# Altium schematic sheet Motherboard PCB.SchDoc
size B; SheetNumber: 1; SheetTotal: 1
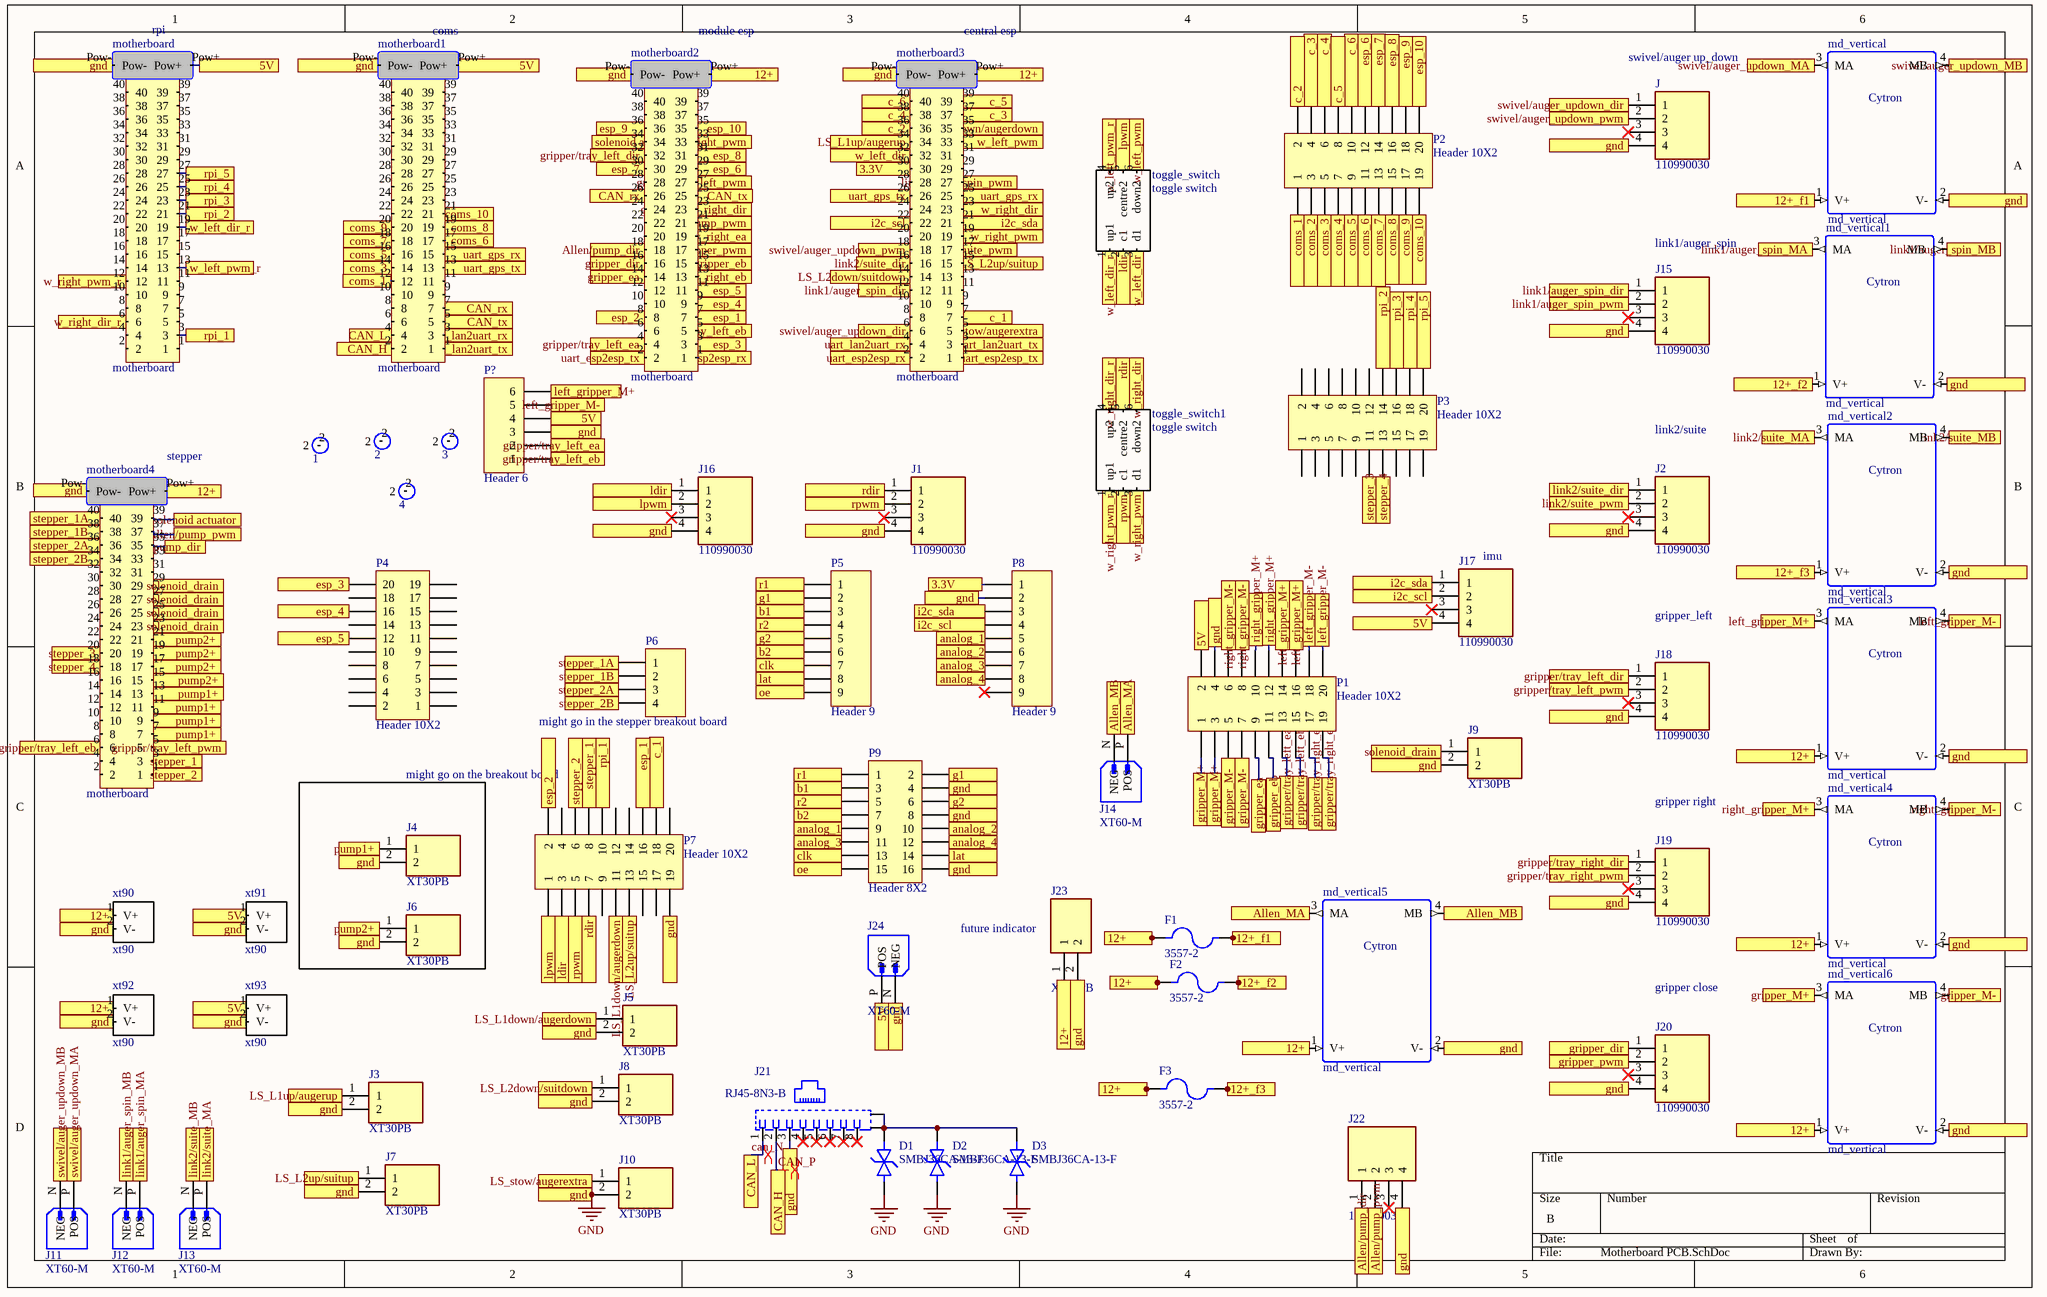
[diagram p0: Motherboard PCB.SchDoc]

## Parts
1  mountinghole_np  [np_mountinghole]  (value not drawn)
2  mountinghole_np  [np_mountinghole]  (value not drawn)
3  mountinghole_np  [np_mountinghole]  (value not drawn)
4  mountinghole_np  [np_mountinghole]  (value not drawn)
D1  SMBJ36CA-13-F  [DIONM4336X250N]
D2  SMBJ36CA-13-F  [DIONM4336X250N]
D3  SMBJ36CA-13-F  [DIONM4336X250N]
F1  3557-2  [FUSE_3557-2]
F2  3557-2  [FUSE_3557-2]
F3  3557-2  [FUSE_3557-2]
J  110990030  [SEEED_110990030]
J1  110990030  [SEEED_110990030]
J2  110990030  [SEEED_110990030]
J3  XT30PB  [XT30PB]
J4  XT30PB  [XT30PB]
J5  XT30PB  [XT30PB]
J6  XT30PB  [XT30PB]
J7  XT30PB  [XT30PB]
J8  XT30PB  [XT30PB]
J9  XT30PB  [XT30PB]
J10  XT30PB  [XT30PB]
J11  XT60-M  [AMASS_XT60-M]
J12  XT60-M  [AMASS_XT60-M]
J13  XT60-M  [AMASS_XT60-M]
J14  XT60-M  [AMASS_XT60-M]
J15  110990030  [SEEED_110990030]
J16  110990030  [SEEED_110990030]
J17  110990030  [SEEED_110990030]
J18  110990030  [SEEED_110990030]
J19  110990030  [SEEED_110990030]
J20  110990030  [SEEED_110990030]
J21  RJ45-8N3-B  [TE_RJ45-8N3-B]
J22  110990030  [SEEED_110990030]
J23  XT30PB  [XT30PB]
J24  XT60-M  [AMASS_XT60-M]
md_vertical  md_vertical  [md_vertical]
md_vertical1  md_vertical  [md_vertical]
md_vertical2  md_vertical  [md_vertical]
md_vertical3  md_vertical  [md_vertical]
md_vertical4  md_vertical  [md_vertical]
md_vertical5  md_vertical  [md_vertical]
md_vertical6  md_vertical  [md_vertical]
motherboard  motherboard  [motherboard 10x2]
motherboard1  motherboard  [motherboard 10x2]
motherboard2  motherboard  [motherboard 10x2]
motherboard3  motherboard  [motherboard 10x2]
motherboard4  motherboard  [motherboard 10x2]
P1  Header 10X2  [HDR2X10]
P2  Header 10X2  [HDR2X10]
P3  Header 10X2  [HDR2X10]
P4  Header 10X2  [HDR2X10]
P5  Header 9  [HDR1X9]
P6  might go in the stepper breakout board  [HDR1X4]
P7  Header 10X2  [HDR2X10]
P8  Header 9  [HDR1X9]
P9  Header 8X2  [HDR2X8]
P?  Header 6  [HDR1X6]
toggle_switch  toggle switch  [toggle switch]
toggle_switch1  toggle switch  [toggle switch]
xt90  xt90  [xt90]
xt91  xt90  [xt90]
xt92  xt90  [xt90]
xt93  xt90  [xt90]

## Blocks framed on the sheet
might go on the breakout board: J4 J6

## Ports
3.3V, 5V, 12+, 12+_f1, 12+_f2, 12+_f3, Allen/pump_dir, Allen/pump_pwm, Allen_MA, Allen_MB, analog_1, analog_2, analog_3, analog_4, b1, b2, c_1, c_2, c_3, c_4, c_5, c_6, CAN_H, CAN_L, CAN_rx, CAN_tx, clk, coms_1, coms_2, coms_3, coms_4, coms_5, coms_6, coms_7, coms_8, coms_9, coms_10, esp_1, esp_2, esp_3, esp_4, esp_5, esp_6, esp_7, esp_8, esp_9, esp_10, g1, g2, gnd, gripper/tray_left_dir, gripper/tray_left_ea, gripper/tray_left_eb, gripper/tray_left_pwm, gripper/tray_right_dir, gripper/tray_right_ea, gripper/tray_right_eb, gripper/tray_right_pwm, gripper_dir, gripper_ea, gripper_eb, gripper_M+, gripper_M-, gripper_pwm, i2c_scl, i2c_sda, lat, ldir, left_gripper_M+, left_gripper_M-, link1/auger_spin_dir, link1/auger_spin_MA, link1/auger_spin_MB, link1/auger_spin_pwm, link2/suite_dir, link2/suite_MA, link2/suite_MB, link2/suite_pwm, lpwm, LS_L1down/augerdown, LS_L1up/augerup, LS_L2down/suitdown, LS_L2up/suitup, LS_stow/augerextra, oe, pump1+, pump2+, r1, r2, rdir, right_gripper_M+, right_gripper_M-, rpi_1, rpi_2, rpi_3, rpi_4, rpi_5, rpwm, solenoid actuator, solenoid_drain, stepper_1, stepper_1A, stepper_1B, stepper_2, stepper_2A, stepper_2B, stepper_3, stepper_4, swivel/auger_updown_dir, swivel/auger_updown_MA, swivel/auger_updown_MB, swivel/auger_updown_pwm, uart_esp2esp_rx, uart_esp2esp_tx, uart_gps_rx, uart_gps_tx, uart_lan2uart_rx, uart_lan2uart_tx, w_left_dir, w_left_dir_r, w_left_pwm, w_left_pwm_r, w_right_dir, w_right_dir_r, w_right_pwm, w_right_pwm_r

## Nets
GND: D1.1 D2.1 D3.1 J.4 J1.4 J2.4 J3.2 J4.2 J5.2 J6.2 J7.2 J8.2 J9.2 J10.2 J15.4 J16.4 J18.4 J19.4 J20.4 J21.3 J22.4 J23.2 J24.N(NEG) md_vertical.2(V-) md_vertical1.2(V-) md_vertical2.2(V-) md_vertical3.2(V-) md_vertical4.2(V-) md_vertical5.2(V-) md_vertical6.2(V-) motherboard.Pow- motherboard1.Pow- motherboard2.Pow- motherboard3.Pow- motherboard4.Pow- P1.4 P7.19 P8.2 P9.4 P9.8 P9.16 P?.3 xt90.2(V-) xt91.2(V-) xt92.2(V-) xt93.2(V-) ; port gnd
3.3V: motherboard3.30 P8.1 ; port 3.3V
5V: J17.4 J24.P(POS) motherboard.Pow+ motherboard1.Pow+ P1.2 P?.4 xt91.1(V+) xt93.1(V+) ; port 5V
12+: F1.1_1 F1.1_2 F2.1_1 F2.1_2 F3.1_1 F3.1_2 J23.1 md_vertical3.1(V+) md_vertical4.1(V+) md_vertical5.1(V+) md_vertical6.1(V+) motherboard2.Pow+ motherboard3.Pow+ motherboard4.Pow+ xt90.1(V+) xt92.1(V+) ; port 12+
12+_f1: F1.2_1 F1.2_2 md_vertical.1(V+) ; port 12+_f1
12+_f2: F2.2_1 F2.2_2 md_vertical1.1(V+) ; port 12+_f2
12+_f3: F3.2_1 F3.2_2 md_vertical2.1(V+) ; port 12+_f3
Allen/pump_dir: J22.1 motherboard2.18 motherboard4.35 ; port Allen/pump_dir
Allen/pump_pwm: J22.2 motherboard2.21 motherboard4.37 ; port Allen/pump_pwm
Allen_MA: J14.P(POS) md_vertical5.3(MA) ; port Allen_MA
Allen_MB: J14.N(NEG) md_vertical5.4(MB) ; port Allen_MB
analog_1: P8.5 P9.9 ; port analog_1
analog_2: P8.6 P9.10 ; port analog_2
analog_3: P8.7 P9.11 ; port analog_3
analog_4: P8.8 P9.12 ; port analog_4
b1: P5.3 P9.3 ; port b1
b2: P5.6 P9.7 ; port b2
c_1: motherboard3.7 P7.18 ; port c_1
c_2: motherboard3.36 P2.2 ; port c_2
c_3: motherboard3.37 P2.4 ; port c_3
c_4: motherboard3.38 P2.6 ; port c_4
c_5: motherboard3.39 P2.8 ; port c_5
c_6: motherboard3.40 P2.10 ; port c_6
can_N: J21.1 motherboard1.4 ; port CAN_L
CAN_P: J21.2 motherboard1.2 ; port CAN_H
CAN_rx: motherboard1.7 motherboard2.26 ; port CAN_rx
CAN_tx: motherboard1.5 motherboard2.25 ; port CAN_tx
clk: P5.7 P9.13 ; port clk
coms_1: motherboard1.12 P2.1 ; port coms_1
coms_2: P2.3 ; port coms_2
coms_3: motherboard1.14 P2.5 ; port coms_3
coms_4: P2.7 ; port coms_4
coms_5: motherboard1.16 P2.9 ; port coms_5
coms_6: motherboard1.17 P2.11 ; port coms_6
coms_7: motherboard1.18 P2.13 ; port coms_7
coms_8: motherboard1.19 P2.15 ; port coms_8
coms_9: motherboard1.20 P2.17 ; port coms_9
coms_10: motherboard1.21 P2.19 ; port coms_10
esp_1: motherboard2.7 P7.16 ; port esp_1
esp_2: motherboard2.8 P7.2 ; port esp_2
esp_3: motherboard2.3 P4.20 ; port esp_3
esp_4: motherboard2.9 P4.16 ; port esp_4
esp_5: motherboard2.11 P4.12 ; port esp_5
esp_6: motherboard2.29 P2.12 ; port esp_6
esp_7: motherboard2.30 P2.14 ; port esp_7
esp_8: motherboard2.31 P2.16 ; port esp_8
esp_9: motherboard2.36 P2.18 ; port esp_9
esp_10: motherboard2.35 P2.20 ; port esp_10
g1: P5.2 P9.2 ; port g1
g2: P5.5 P9.6 ; port g2
gripper/tray_left_dir: J18.1 motherboard2.32 ; port gripper/tray_left_dir
gripper/tray_left_ea: motherboard2.4 P1.13 P?.2 ; port gripper/tray_left_ea
gripper/tray_left_eb: motherboard2.5 motherboard4.6 P1.15 P?.1 ; port gripper/tray_left_eb
gripper/tray_left_pwm: J18.2 motherboard2.27 motherboard4.5 ; port gripper/tray_left_pwm
gripper/tray_right_dir: J19.1 motherboard2.23 ; port gripper/tray_right_dir
gripper/tray_right_ea: motherboard2.19 P1.19 ; port gripper/tray_right_ea
gripper/tray_right_eb: motherboard2.13 P1.17 ; port gripper/tray_right_eb
gripper/tray_right_pwm: J19.2 motherboard2.33 ; port gripper/tray_right_pwm
gripper_dir: J20.1 motherboard2.16 ; port gripper_dir
gripper_ea: motherboard2.14 P1.9 ; port gripper_ea
gripper_eb: motherboard2.15 P1.11 ; port gripper_eb
gripper_M+: md_vertical6.3(MA) P1.1 P1.3 ; port gripper_M+
gripper_M-: md_vertical6.4(MB) P1.5 P1.7 ; port gripper_M-
gripper_pwm: J20.2 motherboard2.17 ; port gripper_pwm
i2c_scl: J17.2 motherboard3.22 P8.4 ; port i2c_scl
i2c_sda: J17.1 motherboard3.21 P8.3 ; port i2c_sda
lat: P5.8 P9.14 ; port lat
ldir: J16.1 P7.3 toggle_switch.2(c1) ; port ldir
left_gripper_M+: md_vertical3.3(MA) P1.14 P1.16 P?.6 ; port left_gripper_M+
left_gripper_M-: md_vertical3.4(MB) P1.18 P1.20 P?.5 ; port left_gripper_M-
link1/auger_spin_dir: J15.1 motherboard3.12 ; port link1/auger_spin_dir
link1/auger_spin_MA: J12.P(POS) md_vertical1.3(MA) ; port link1/auger_spin_MA
link1/auger_spin_MB: J12.N(NEG) md_vertical1.4(MB) ; port link1/auger_spin_MB
link1/auger_spin_pwm: J15.2 motherboard3.27 ; port link1/auger_spin_pwm
link2/suite_dir: J2.1 motherboard3.16 ; port link2/suite_dir
link2/suite_MA: J13.P(POS) md_vertical2.3(MA) ; port link2/suite_MA
link2/suite_MB: J13.N(NEG) md_vertical2.4(MB) ; port link2/suite_MB
link2/suite_pwm: J2.2 motherboard3.17 ; port link2/suite_pwm
lpwm: J16.2 P7.1 toggle_switch.5(centre2) ; port lpwm
LS_L1down/augerdown: J5.1 motherboard3.35 P7.11 ; port LS_L1down/augerdown
LS_L1up/augerup: J3.1 motherboard3.34 ; port LS_L1up/augerup
LS_L2down/suitdown: J8.1 motherboard3.14 ; port LS_L2down/suitdown
LS_L2up/suitup: J7.1 motherboard3.15 P7.13 ; port LS_L2up/suitup
LS_stow/augerextra: J10.1 motherboard3.5 ; port LS_stow/augerextra
oe: P5.9 P9.15 ; port oe
pump1+: J4.1 motherboard4.7 motherboard4.9 motherboard4.11 motherboard4.13 ; port pump1+
pump2+: J6.1 motherboard4.15 motherboard4.17 motherboard4.19 motherboard4.21 ; port pump2+
r1: P5.1 P9.1 ; port r1
r2: P5.4 P9.5 ; port r2
rdir: J1.1 P7.7 toggle_switch1.5(centre2) ; port rdir
right_gripper_M+: md_vertical4.3(MA) P1.10 P1.12 ; port right_gripper_M+
right_gripper_M-: md_vertical4.4(MB) P1.6 P1.8 ; port right_gripper_M-
rpi_1: motherboard.3 P7.10 ; port rpi_1
rpi_2: motherboard.21 P3.14 ; port rpi_2
rpi_3: motherboard.23 P3.16 ; port rpi_3
rpi_4: motherboard.25 P3.18 ; port rpi_4
rpi_5: motherboard.27 P3.20 ; port rpi_5
rpwm: J1.2 P7.5 toggle_switch1.2(c1) ; port rpwm
solenoid actuator: motherboard2.34 motherboard4.39 ; port solenoid actuator
solenoid_drain: J9.1 motherboard4.23 motherboard4.25 motherboard4.27 motherboard4.29 ; port solenoid_drain
stepper_1: motherboard4.3 P7.8 ; port stepper_1
stepper_1A: motherboard4.40 P6.1 ; port stepper_1A
stepper_1B: motherboard4.38 P6.2 ; port stepper_1B
stepper_2: motherboard4.1 P7.6 ; port stepper_2
stepper_2A: motherboard4.36 P6.3 ; port stepper_2A
stepper_2B: motherboard4.34 P6.4 ; port stepper_2B
stepper_3: motherboard4.20 P3.11 ; port stepper_3
stepper_4: motherboard4.18 P3.13 ; port stepper_4
swivel/auger_updown_dir: J.1 motherboard3.6 ; port swivel/auger_updown_dir
swivel/auger_updown_MA: J11.P(POS) md_vertical.3(MA) ; port swivel/auger_updown_MA
swivel/auger_updown_MB: J11.N(NEG) md_vertical.4(MB) ; port swivel/auger_updown_MB
swivel/auger_updown_pwm: J.2 motherboard3.18 ; port swivel/auger_updown_pwm
uart_esp2esp_rx: motherboard2.1 motherboard3.2 ; port uart_esp2esp_rx
uart_esp2esp_tx: motherboard2.2 motherboard3.1 ; port uart_esp2esp_tx
uart_gps_rx: motherboard1.15 motherboard3.25 ; port uart_gps_rx
uart_gps_tx: motherboard1.13 motherboard3.26 ; port uart_gps_tx
uart_lan2uart_rx: motherboard1.3 motherboard3.4 ; port uart_lan2uart_rx
uart_lan2uart_tx: motherboard1.1 motherboard3.3 ; port uart_lan2uart_tx
w_left_dir: motherboard3.32 toggle_switch.3(d1) ; port w_left_dir
w_left_dir_r: motherboard.19 toggle_switch.1(up1) ; port w_left_dir_r
w_left_pwm: motherboard3.33 toggle_switch.6(down2) ; port w_left_pwm
w_left_pwm_r: motherboard.13 toggle_switch.4(up2) ; port w_left_pwm_r
w_right_dir: motherboard3.23 toggle_switch1.6(down2) ; port w_right_dir
w_right_dir_r: motherboard.6 toggle_switch1.4(up2) ; port w_right_dir_r
w_right_pwm: motherboard3.19 toggle_switch1.3(d1) ; port w_right_pwm
w_right_pwm_r: motherboard.12 toggle_switch1.1(up1) ; port w_right_pwm_r
NetD1_2: D1.2 D2.2 D3.2 J21.9(S1) J21.10(S2)

Not connected (* = marked no-connect by the designer): 1 2; 2 2; 3 2; 4 2; J 3*; J1 3*; J2 3*; J15 3*; J16 3*; J17 3*; J18 3*; J19 3*; J20 3*; J21 4* 5* 6* 7* 8*; J22 3*; motherboard 1 2 4 5 7 8 9 10 11 14 15 16 17 18 20 22 24 26 28 29 30 31 32 33 34 35 36 37 38 39 40; motherboard1 6 8 9 10 11 22 23 24 25 26 27 28 29 30 31 32 33 34 35 36 37 38 39 40; motherboard2 6 10 12 20 22 24 28 37 38 39 40; motherboard3 8 9 10 11 13 20 24 28 29 31; motherboard4 2 4 8 10 12 14 16 22 24 26 28 30 31 32 33; P3 1 2 3 4 5 6 7 8 9 10 12 15 17 19; P4 1 2 3 4 5 6 7 8 9 10 11 13 14 15 17 18 19; P7 4 9 12 14 15 17 20; P8 9*

## Layout directives
differential pair: can_N, CAN_P

## Notes on the sheet
- (near motherboard) rpi
- (near motherboard1) coms
- (near motherboard2) module esp
- (near motherboard3) central esp
- (near J) swivel/auger up_down
- (near J15) link1/auger_spin
- (near J2) link2/suite
- (near motherboard4) stepper
- (near J17) imu
- gripper_left
- gripper right
- (near J23) future indicator
- gripper close
- (in symbol md_vertical) Cytron

## Library data of the parts
D1-D3 = SMBJ36CA-13-F: SMBJ36CA Series 600 W 36 V Surface Mount Bi-Directional TVS Diode - DO-214AA; Package: None; MP: SMBJ36CA-13-F; Value: *; Availability: Unavailable; Price: None
J J1 J2 J15-J20 J22 = 110990030: GROVE 2MM 4PIN VERT CONN 10PCS; MF: Seeed Technology; Arrow_Electronics-Purchase-URL: https://snapeda.com/shop?store=Arrow+Electronics&id=583576; Availability: Good; Package: None; Price: None; Mouser-Purchase-URL: https://snapeda.com/shop?store=Mouser&id=583576; MP: 110990030; SnapEDA_Link: https://www.snapeda.com/parts/110990030/Seeed%20Technology%20Co.,%20Ltd/view-part/583576/?ref=snap; Value: *
J3-J10 J23 = XT30PB: Connector; Manufacturer_Name: Amass; Datasheet Link: https://www.tme.eu/Document/4acc913878197f8c2e30d4b8cdc47230/XT30UPB%20SPEC.pdf; Height: 10.7mm; Manufacturer_Part_Number: XT30PB
J11-J14 J24 = XT60-M: Plug; DC supply; XT60; male; PIN: 2; for cable; soldered; 30A; 500V; MF: AMASS; Package: Package; Availability: Not in stock; SnapEDA_Link: https://www.snapeda.com/parts/XT60-M/AMASS/view-part/?ref=snap; Check_prices: https://www.snapeda.com/parts/XT60-M/AMASS/view-part/?ref=eda; MP: XT60-M; Price: None; Value: *
J21 = RJ45-8N3-B: Connector RJ-45 Female 8 Position 2.54mm Solder Right Angle Through Hole 8 Terminal; MF: TE Connectivity; MP: RJ45-8N3-B; Price: None; Availability: Unavailable; Package: None; SnapEDA_Link: https://www.snapeda.com/parts/RJ45-8N3-B/TE%20Connectivity%20Corcom%20Filters/view-part/2770351/?ref=snap; TE_purchase_URL: https://www.te.com/usa-en/product-1-6609212-3.html?te_bu=Cor&te_type=disp&te_campaign=seda_glo_cor-seda-global-disp-prtnr-fy19-seda-model-bom-cta_sma-317_1&elqCampaignId=32493; Value: *
P1-P4 P7 = Header 10X2: Header, 10-Pin, Dual row; LatestRevisionDate: 17-Jul-2002; LatestRevisionNote: Re-released for DXP Platform.; Publisher: Altium Limited
P5 P8 = Header 9: Header, 9-Pin; LatestRevisionDate: 17-Jul-2002; LatestRevisionNote: Re-released for DXP Platform.; Publisher: Altium Limited
P6 = Header 4: Header, 4-Pin; LatestRevisionDate: 17-Jul-2002; LatestRevisionNote: Re-released for DXP Platform.; Publisher: Altium Limited
P9 = Header 8X2: Header, 8-Pin, Dual row; LatestRevisionDate: 17-Jul-2002; LatestRevisionNote: Re-released for DXP Platform.; Publisher: Altium Limited
P? = Header 6: Header, 6-Pin; LatestRevisionDate: 17-Jul-2002; LatestRevisionNote: Re-released for DXP Platform.; Publisher: Altium Limited
F1-F3 = 3557-2: Package: None; MP: 3557-2; Value: *; Availability: Unavailable; Price: None